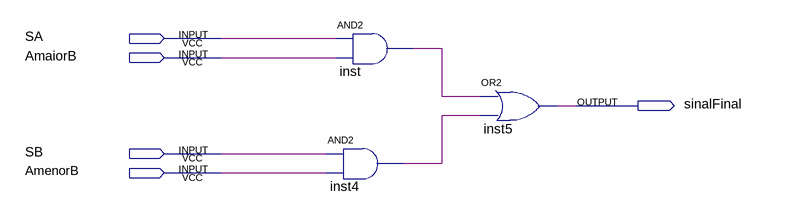
[diagram p0: schematic sheet]
// Quartus schematic sinal_final.bdf as structural Verilog: 3 symbols, 5 pins
module sinal_final (
  input  SA,
  input  AmaiorB,
  input  SB,
  input  AmenorB,
  output sinalFinal
);

  wire inst4_out, inst_out;

  and inst (inst_out, SA, AmaiorB);
  and inst4 (inst4_out, SB, AmenorB);
  or inst5 (sinalFinal, inst_out, inst4_out);
endmodule
